# EAGLE design paludarium3 (EAGLE 7.7.0)
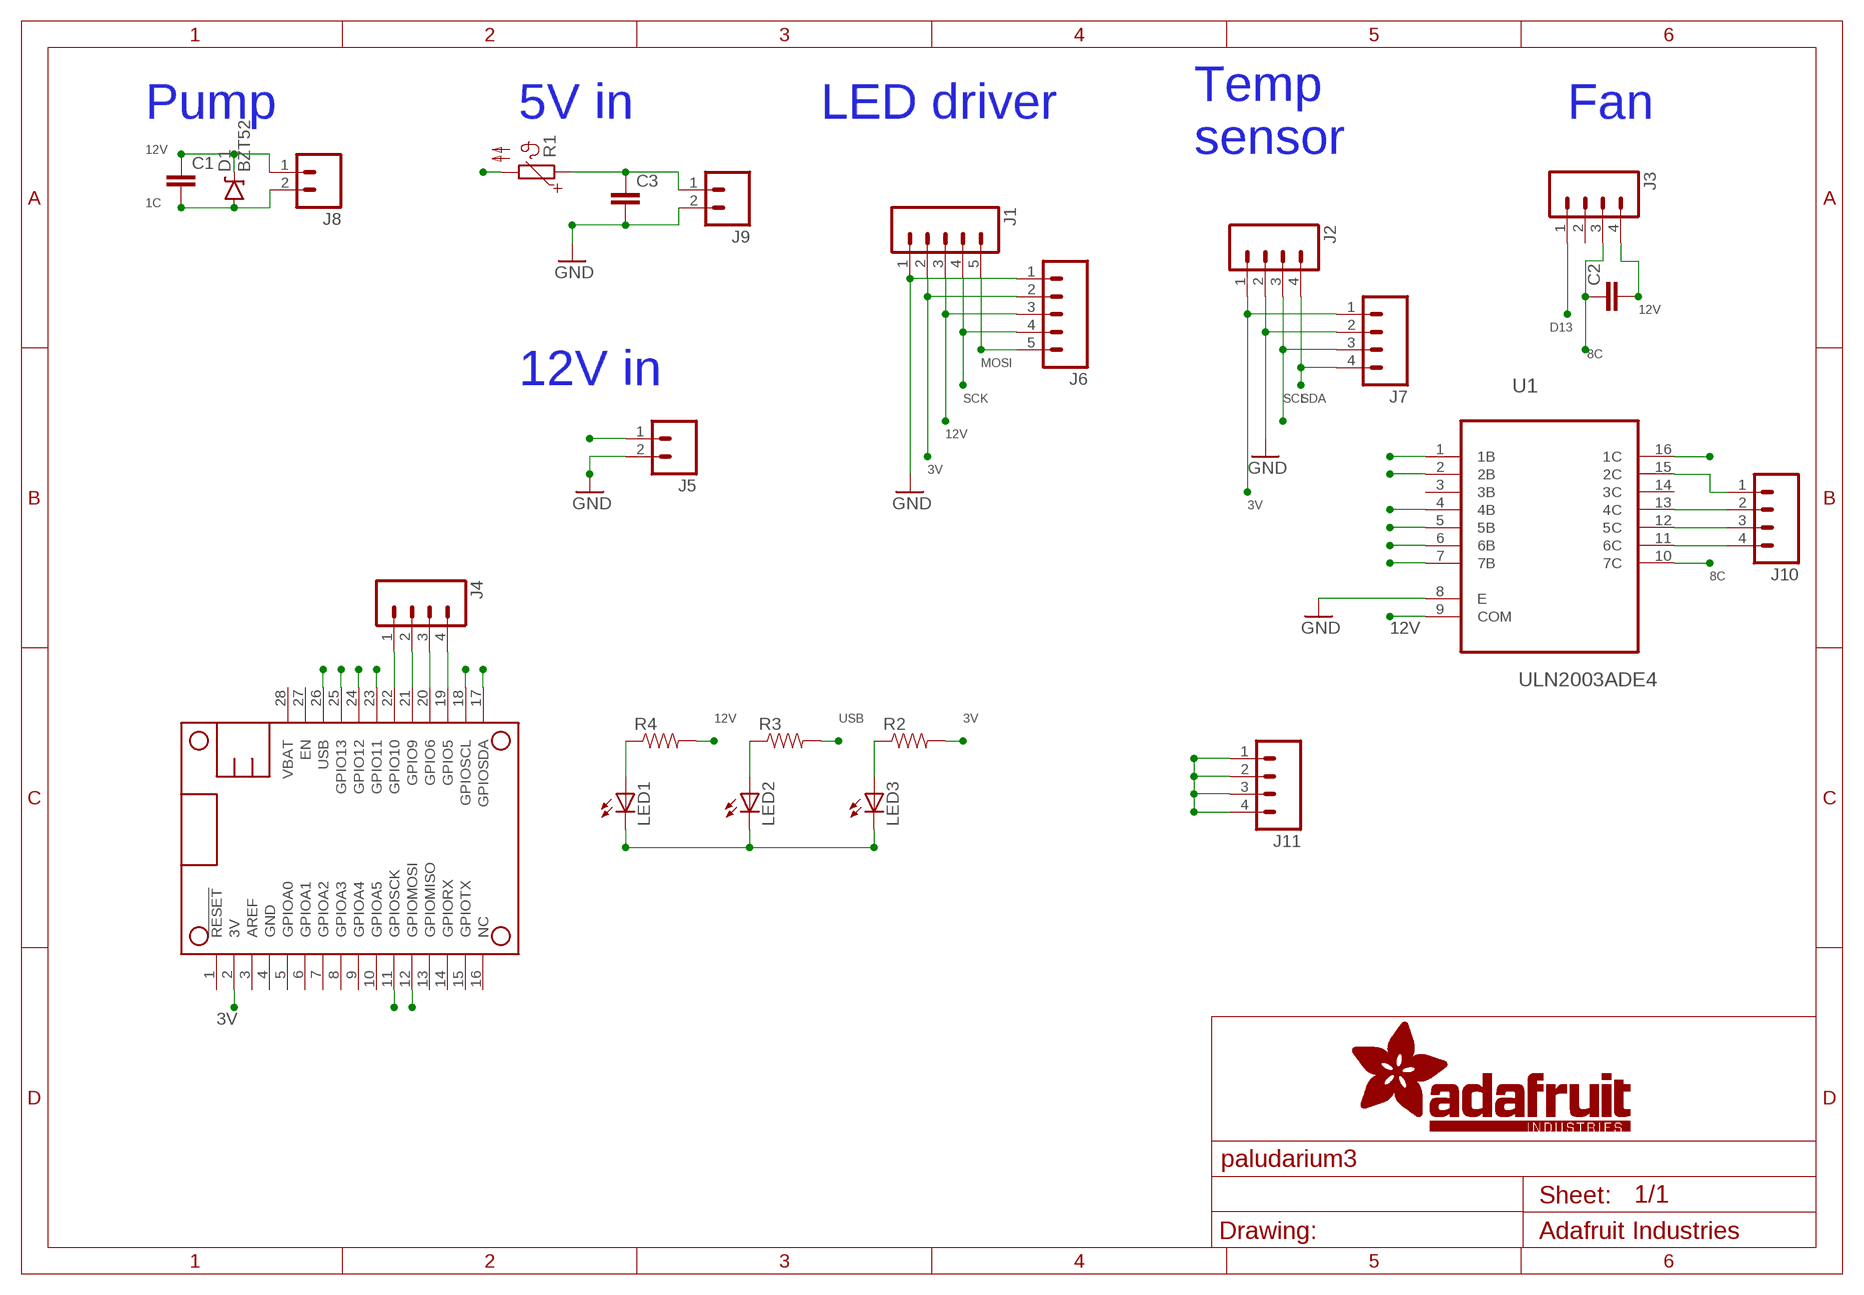
[diagram p0: schematic, sheet 1]

## Parts
C1  C-EU025-030X050  [C025-030X050]
C2  C-EU025-030X050  [C025-030X050]
C3  C-EU025-030X050  [C025-030X050]
D1  BZT52  DIODE-ZENER  [DIODE-BZT52]
J1  M05NO_SILK  [1X05_NO_SILK]
J2  M04NO_SILK_ALL_ROUND  [1X04_NO_SILK_ALL_ROUND]
J3  M04NO_SILK_ALL_ROUND  [1X04_NO_SILK_ALL_ROUND]
J4  M04NO_SILK_ALL_ROUND  [1X04_NO_SILK_ALL_ROUND]
J5  M021X02_NO_SILK  [1X02_NO_SILK]
J6  M05NO_SILK  [1X05_NO_SILK]
J7  M04NO_SILK_ALL_ROUND  [1X04_NO_SILK_ALL_ROUND]
J8  M021X02_NO_SILK  [1X02_NO_SILK]
J9  M021X02_NO_SILK  [1X02_NO_SILK]
J10  M04NO_SILK_ALL_ROUND  [1X04_NO_SILK_ALL_ROUND]
J11  M04NO_SILK_ALL_ROUND  [1X04_NO_SILK_ALL_ROUND]
LED1  LED3MM  [LED3MM]
LED2  LED3MM  [LED3MM]
LED3  LED3MM  [LED3MM]
MS1  FEATHERWING  [FEATHERWING]
R1  PTC679  [P679]
R2  RESISTORAXIAL-0.3  [AXIAL-0.3]
R3  RESISTORAXIAL-0.3  [AXIAL-0.3]
R4  RESISTORAXIAL-0.3  [AXIAL-0.3]
U1  ULN2003ADE4  [SOIC127P600X175-16N]

## Nets
1C: C1.2 D1.A J8.2 U1.16(1C)
3V: J1.2 J2.1 J6.2 J7.1 MS1.2(3V) R2.P$2
5VIN: C3.1 J9.1 R1.1
8C: C2.1 J3.3 U1.10(7C)
12V: C1.1 C2.2 D1.C J1.3 J3.4 J5.1 J6.3 J8.1 J11.1 J11.2 J11.3 J11.4 R4.P$2 U1.9(COM)
D0: J4.2 MS1.21(GPIO9) U1.4(4B)
D2: J4.4 MS1.19(GPIO5) U1.1(1B)
D12: MS1.24(GPIO12) U1.6(6B)
D13: J3.1 MS1.23(GPIO11)
D14: MS1.25(GPIO13) U1.7(7B)
D15: J4.1 MS1.22(GPIO10) U1.5(5B)
D16: J4.3 MS1.20(GPIO6) U1.2(2B)
GND: C3.2 J1.1 J2.2 J5.2 J6.1 J7.2 J9.2 LED1.K(C) LED2.K(C) LED3.K(C) U1.8(E)
MOSI: J1.5 J6.5 MS1.12(GPIOMOSI)
N$30: J10.4 U1.11(6C)
N$31: J10.3 U1.12(5C)
N$32: J10.1 U1.15(2C)
N$33: LED1.A R4.P$1
N$34: J10.2 U1.13(4C)
N$39: LED3.A R2.P$1
N$40: LED2.A R3.P$1
SCK: J1.4 J6.4 MS1.11(GPIOSCK)
SCL: J2.3 J7.3 MS1.18(GPIOSCL)
SDA: J2.4 J7.4 MS1.17(GPIOSDA)
USB: MS1.26(USB) R1.2 R3.P$2
Unconnected: J3.2 MS1.1(!RESET) MS1.3(AREF) MS1.5(GPIOA0) MS1.6(GPIOA1) MS1.7(GPIOA2) MS1.8(GPIOA3) MS1.9(GPIOA4) MS1.10(GPIOA5) MS1.13(GPIOMISO) MS1.14(GPIORX) MS1.15(GPIOTX) MS1.16(NC) MS1.27(EN) MS1.28(VBAT) U1.3(3B) U1.14(3C)

## Notes on the sheet
- Pump | 5V in | LED driver | Fan
- Temp 
  sensor
- 12V in

## Power pins joined to a net without a drawn wire
GND: MS1.4(GND)

## Library data of the parts
C1-C3 = resistor:C-EU: CAPACITOR, European symbol
D1 = SparkFun-DiscreteSemi:DIODE-ZENER: Zener Diode Production Part - 8199 3.4V Zener Voltage; PROD-ID: DIO-08199
J1 J6 = SparkFun-Connectors:M05: Header 5 Standard 5-pin 0.1" header. Use with straight break away headers (SKU : PRT-00116), right angle break away headers (PRT-00553), swiss pins (PRT-00743), machine pins (PRT-00117), and female headers (PRT-00115). Molex polarized connector foot print use with SKU : PRT-08230 with associated crimp pins and housings.
J2-J4 J7 J10 J11 = SparkFun-Connectors:M04: Header 4 Standard 4-pin 0.1" header. Use with straight break away headers (SKU : PRT-00116), right angle break away headers (PRT-00553), swiss pins (PRT-00743), machine pins (PRT-00117), and female headers (PRT-00115). Molex polarized connector foot print use with SKU : PRT-08231 with associated crimp pins and housings. 1MM SMD Version SKU: PRT-10208; PROD_ID: CONN-09696
J5 J8 J9 = SparkFun-Connectors:M02: Standard 2-pin 0.1" header. Use with - straight break away headers ( PRT-00116) - right angle break away headers (PRT-00553) - swiss pins (PRT-00743) - machine pins (PRT-00117) - female headers (PRT-00115) Molex polarized connector foot print use with: PRT-08233 with associated crimp pins and housings. 2.54_SCREWTERM for use with PRT-10571. 3.5mm Screw Terminal footprints for PRT-08084 5mm Screw Terminal footprints for use with PRT-08432
LED1-LED3 = led:LED: LED OSRAM: - CHIPLED LG R971, LG N971, LY N971, LG Q971, LY Q971, LO R971, LY R971 LH N974, LH R974 LS Q976, LO Q976, LY Q976 LO Q996 - Hyper CHIPLED LW Q18S LB Q993, LB Q99A, LB R99A - SideLED LS A670, LO A670, LY A670, LG A670, LP A670 LB A673, LV A673, LT A673, LW A673 LH A674 LY A675 LS A676, LA A676, LO A676, LY A676, LW A676 LS A679, LY A679, LG A679 - Hyper Micro SIDELED® LS Y876, LA Y876, LO Y876, LY Y876 LT Y87S - SmartLED LW L88C, LW L88S LB L89C, LB L89S, LG L890 LS L89K, LO L89K, LY L89K LS L896, LA L896, LO L896, LY L896 - TOPLED LS T670, LO T670, LY T670, LG T670, LP T670 LSG T670, LSP T670, LSY T670, LOP T670, LYG T670 LG T671, LOG T671, LSG T671 LB T673, LV T673, LT T673, LW T673 LH T674 LS T676, LA T676, LO T676, LY T676, LB T676, LH T676, LSB T676, LW T676 LB T67C, LV T67C, LT T67C, LS T67K, LO T67K, LY T67K, LW E67C LS E67B, LA E67B, LO E67B, LY E67B, LB E67C, LV E67C, LT E67C LW T67C LS T679, LY T679, LG T679 LS T770, LO T770, LY T770, LG T770, LP T770 LB T773, LV T773, LT T773, LW T773 LH T774 LS E675, LA E675, LY E675, LS T675 LS T776, LA T776, LO T776, LY T776, LB T776 LHGB T686 LT T68C, LB T68C - Hyper Mini TOPLED® LB M676 - Mini TOPLED Santana® LG M470 LS M47K, LO M47K, LY M47K Source: http://www.osram.convergy.de LUXEON: - LUMILED® LXK2-PW12-R00, LXK2-PW12-S00, LXK2-PW14-U00, LXK2-PW14-V00 LXK2-PM12-R00, LXK2-PM12-S00, LXK2-PM14-U00 LXK2-PE12-Q00, LXK2-PE12-R00, LXK2-PE12-S00, LXK2-PE14-T00, LXK2-PE14-U00 LXK2-PB12-K00, LXK2-PB12-L00, LXK2-PB12-M00, LXK2-PB14-N00, LXK2-PB14-P00, LXK2-PB14-Q00 LXK2-PR12-L00, LXK2-PR12-M00, LXK2-PR14-Q00, LXK2-PR14-R00 LXK2-PD12-Q00, LXK2-PD12-R00, LXK2-PD12-S00 LXK2-PH12-R00, LXK2-PH12-S00 LXK2-PL12-P00, LXK2-PL12-Q00, LXK2-PL12-R00 Source: www.luxeon.com KINGBRIGHT: KA-3528ASYC Source: www.kingbright.com
MS1 = microbuilder:FEATHERWING
R1 = ptc-ntc:PTC679: PHILIPS PTC; OC_FARNELL: unknown; OC_NEWARK: unknown
R2-R4 = SparkFun-Resistors:RESISTOR: Resistor Basic schematic elements and footprints for 0603, 1206, and PTH resistors.
U1 = Texas Instruments_By_element14_Batch_1:ULN2003ADE4: DARLINGTON TRANSISTOR ARRAYS; MPN: ULN2003ADE4; OC_FARNELL: 1125398; OC_NEWARK: 93K1078; PACKAGE: SOIC-16; SUPPLIER: Texas Instruments

## Board
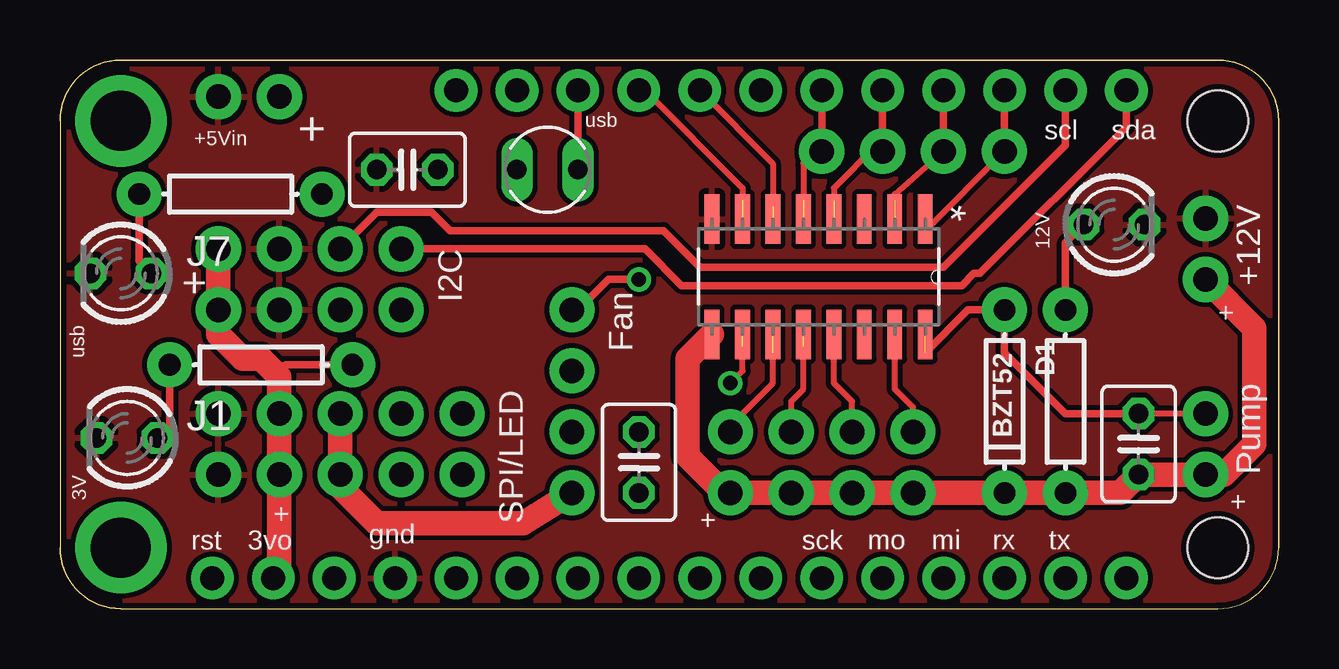
[diagram p1: board, top side]
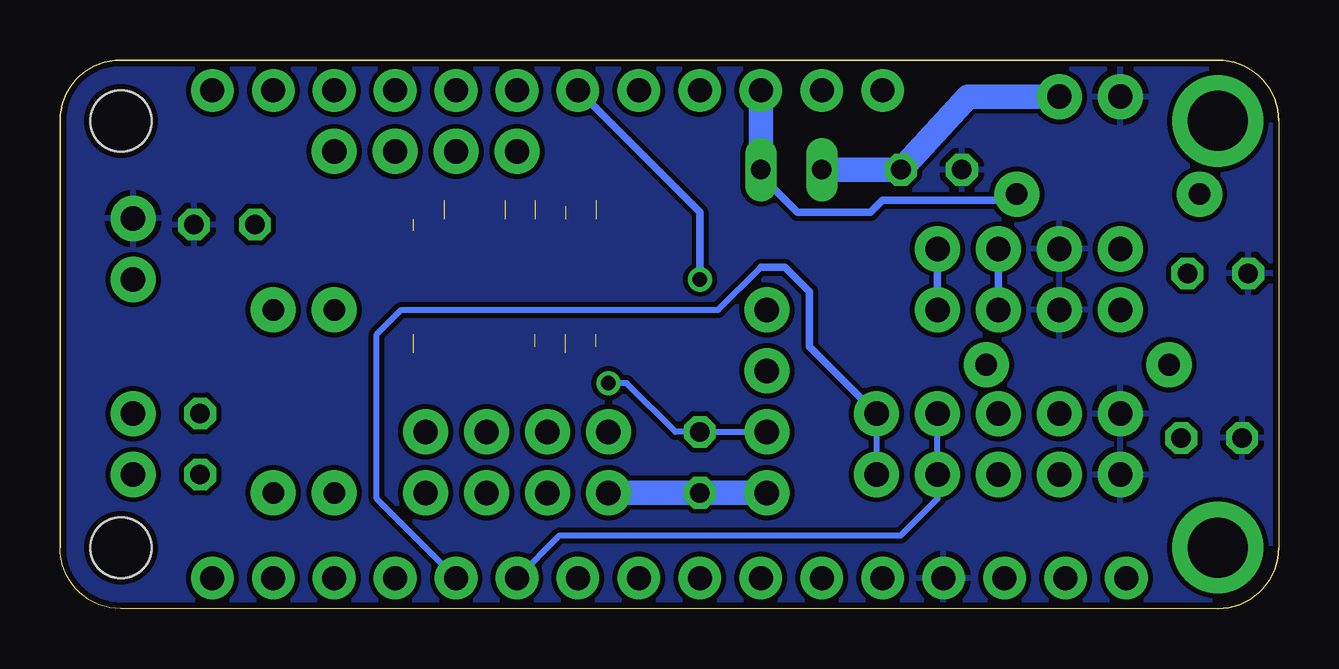
[diagram p2: board, bottom side, seen from below]

Size 50.8 x 22.86 mm. Coordinates in mm from the lower left corner, seen from the top.
Outline: 50.8,2.54 50.8,20.32 arc90 48.26,22.86 2.54,22.86 arc90 0,20.32
Outline: 2.54,0 arc-90 0,2.54
Copper layers (1*16): Top 0.035mm / dielectric 1.5mm / Bottom 0.035mm
Design rules "adafruit": minimum track width 8mil, minimum drill 15.5mil, track to track 8mil, track to pad 8mil, pad to pad 8mil, via to via 8mil, smd to smd 8mil, copper to edge 10mil, drill to drill 8mil, minimum pad ring 10mil, minimum via ring 8mil, stop-mask expansion 2mil, vias tented up to drill 20mil, thermal gap 10mil

### Footprints (pad centres in the part's own frame; a part is rotated, then mirrored left to right if it is on the bottom)
C025-030X050 = drill 0.813 octagon: 1 -1.27,0; 2 1.27,0
DIODE-BZT52 = drill 0.9 pad 1.88: A -3.81,0; C 3.81,0
1X05_NO_SILK = drill 1.016 pad 1.88: 1 0,0; 2 2.54,0; 3 5.08,0; 4 7.62,0; 5 10.16,0
1X04_NO_SILK_ALL_ROUND = drill 1.016 pad 1.88: 1 0,0; 2 2.54,0; 3 5.08,0; 4 7.62,0
1X02_NO_SILK = drill 1.016 pad 1.88: 1 0,0; 2 2.54,0
LED3MM = drill 0.813 octagon: A -1.27,0; K 1.27,0
FEATHERWING = drill 1 pad 1.778: 1 6.35,1.27; 2 8.89,1.27; 3 11.43,1.27; 4 13.97,1.27; 5 16.51,1.27; 6 19.05,1.27; 7 21.59,1.27; 8 24.13,1.27; 9 26.67,1.27; 10 29.21,1.27; 11 31.75,1.27; 12 34.29,1.27; 13 36.83,1.27; 14 39.37,1.27; 15 41.91,1.27; 16 44.45,1.27; 17 44.45,21.59; 18 41.91,21.59; 19 39.37,21.59; 20 36.83,21.59; 21 34.29,21.59; 22 31.75,21.59; 23 29.21,21.59; 24 26.67,21.59; 25 24.13,21.59; 26 21.59,21.59; 27 19.05,21.59; 28 16.51,21.59 | drill 2.5 pad 3.81: P$1 2.54,20.32; P$2 2.54,2.54 | hole 2.54: 48.26,20.32; 48.26,2.54
P679 = drill 0.813 long: 1 -1.27,0; 2 1.27,0
AXIAL-0.3 = drill 0.9 pad 1.88: P$1 -3.81,0; P$2 3.81,0
SOIC127P600X175-16N = smd 2.057 x 0.61: 1 -4.801,8.89; 2 -4.801,7.62; 3 -4.801,6.35; 4 -4.801,5.08; 5 -4.801,3.81; 6 -4.801,2.54; 7 -4.801,1.27; 8 -4.801,0; 9 0,0; 10 0,1.27; 11 0,2.54; 12 0,3.81; 13 0,5.08; 14 0,6.35; 15 0,7.62; 16 0,8.89

### Placement (x,y rotation side)
C1  44.96,6.86 90 top
C2  24.13,6.1 270 top
C3  14.48,18.29 180 top
D1  39.37,8.64 270 top
J1  6.6,5.59 0 top
J2  6.6,14.99 0 top
J3  21.34,12.45 270 top
J4  31.75,19.05 0 top
J5  47.75,13.72 90 top
J6  6.6,8.13 0 top
J7  6.6,12.45 0 top
J8  47.75,5.59 90 top
J9  9.14,21.34 180 top
J10  35.56,7.37 180 top
J11  27.94,4.83 0 top
LED1  43.94,16 0 top
LED2  2.54,13.97 180 top
LED3  2.79,7.11 180 top
MS1  0,0 0 top
R1  20.32,18.29 0 top
R2  8.38,10.16 0 top
R3  7.11,17.27 0 top
R4  41.91,8.64 270 top
U1  27.18,11.43 270 top

### Tracks (layer width: path | path; a pad name or v marks a point on that pad's centre or on a via)
1C  (1 unrouted)
  Top 0.254: J8.2 C1.2
  Top 0.305: 36.07,10.67 37.85,12.45 D1.A 39.37,10.67 41.91,8.13 C1.2
3V
  Top 0.305: R2.P$2 9.4,10.16 9.02,9.78
  Top 1.016: MS1.2 9.14,1.52 J1.2 J6.2 9.14,9.65 9.02,9.78 8.38,10.41 7.62,10.41 6.6,11.43 J7.1 J2.1
5VIN
  Bottom 1.016: R1.1 C3.1 12.95,21.34 J9.1
8C  (via drill 0.6)  (1 unrouted)
  Top 0.254: v27.94,9.4 28.45,9.91 28.45,10.92
  Bottom 0.254: J3.3 C2.1 25.15,7.37 27.18,9.4 v27.94,9.4
12V
  Top 1.016: J5.1 49.78,11.68 49.78,6.86 48.51,5.59 J8.1 C1.1 44.2,4.83 R4.P$2 D1.C J11.4 J11.3 J11.2 J11.1 27.69,4.83 26.16,6.35 26.16,10.41 U1.9 | J3.4 19.3,3.56 13.21,3.56 11.68,5.08 J1.3 J6.3
  Bottom 1.016: J3.4 C2.2 J11.1
D0  (1 unrouted)
  Top 0.254: J4.2 34.04,19.3 32.26,17.53 32.26,17.02
  Top 0.305: J4.2 MS1.21
D2  (1 unrouted)
  Top 0.254: J4.4 36.07,15.75
  Top 0.305: J4.4 MS1.19
D12  (1 unrouted)
  Top 0.254: MS1.24 29.72,18.54 29.72,16.76
D13  (via drill 0.6)
  Top 0.305: J3.1 21.59,12.45 22.86,13.72 v24.13,13.72
  Bottom 0.305: MS1.23 24.13,16.51 v24.13,13.72
D14  (1 unrouted)
  Top 0.254: MS1.25 24.38,21.59 28.45,17.53 28.45,17.02
D15  (1 unrouted)
  Top 0.254: J4.1 30.99,18.54 30.99,17.02
  Top 0.305: J4.1 MS1.22
D16  (1 unrouted)
  Top 0.254: J4.3 34.8,17.27 34.8,17.02
  Top 0.305: J4.3 MS1.20
GND
  pour Bottom: 50.8,22.86 50.8,-0.25 0,-0.25 0,22.86
  pour Top: 0,22.86 50.8,22.86 50.8,0 0,0
MOSI
  Bottom 0.254: MS1.12 37.59,4.57 37.59,11.43 36.58,12.45 23.37,12.45 21.59,14.22 | J6.5 J1.5
  Bottom 0.305: 21.59,14.22 20.57,14.22 19.56,13.21 19.56,10.92 J6.5
N$28  (via drill 0.6)
  other vias: 27.94,9.4
N$30  (1 unrouted)
  Top 0.254: J10.4 27.94,7.62 29.72,9.4 29.72,10.67
N$31  (1 unrouted)
  Top 0.254: J10.3 30.48,8.64 30.99,9.14 30.99,10.92
N$32
  Top 0.254: J10.1 35.56,8.38 34.8,9.14 U1.15
N$33
  Top 0.305: R4.P$1 41.91,15.24 LED1.A
N$34
  Top 0.254: J10.2 33.02,8.64 32.26,9.4 U1.13
N$39
  Top 0.305: R2.P$1 4.57,7.62 LED3.A
N$40
  Top 0.305: R3.P$1 3.3,14.48 LED2.A
SCK
  Bottom 0.254: MS1.11 29.97,3.05 15.75,3.05 14.22,4.57 J1.4 J6.4
SCL
  Top 0.305: J2.3 13.21,16.51 15.49,16.51 16.26,15.75 25.15,15.75 26.67,14.22 36.83,14.22 41.91,19.3 MS1.18
  Bottom 0.305: J2.3 J7.3
SDA
  Top 0.305: J2.4 24.38,14.99 25.91,13.46 37.59,13.46 38.1,13.97 38.35,13.97 44.45,20.07 MS1.17
  Bottom 0.305: J2.4 J7.4
USB
  Top 0.305: R1.2 MS1.26
  Bottom 0.305: R1.2 21.59,18.03 20.07,16.51 17.02,16.51 16.51,17.02 11.18,17.02 R3.P$2
  Bottom 1.016: R1.2 MS1.26

### Text on the board
tPlace: usb | scl | sda | +5Vin | + | 12V | I2C | + | Fan | +12V | + | usb | Pump | 3V | + | SPI/LED | + | gnd | + | rst | 3vo | sck | mo | mi | rx | tx